# Altium schematic sheet OxygenSensor.SchDoc
size A4; SheetNumber: 5; SheetTotal: 10
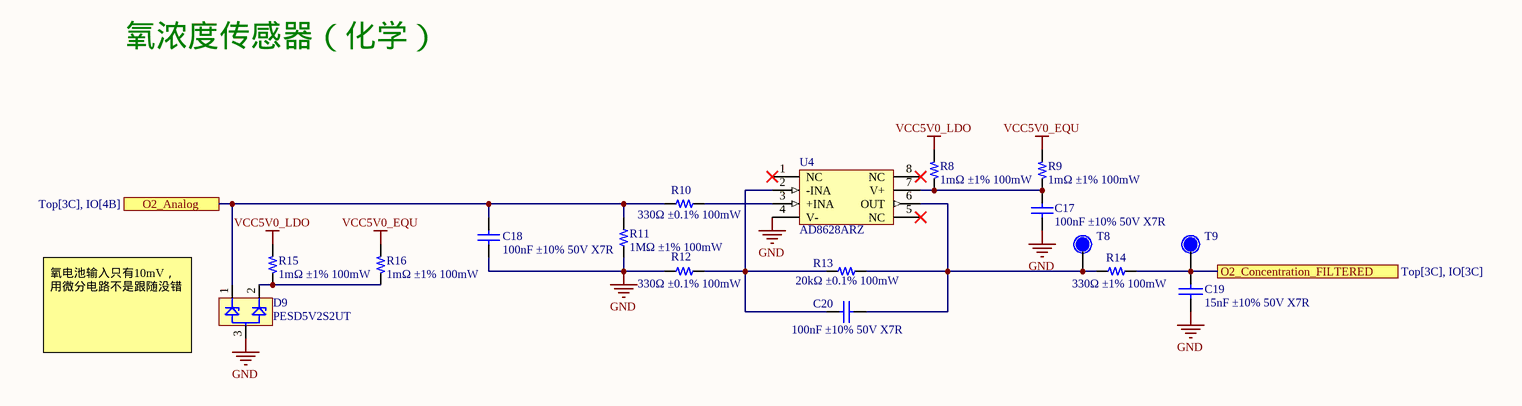
[diagram p0: OxygenSensor.SchDoc]

## Parts
C17  100nF ±10% 50V X7R  [C-0603]
C18  100nF ±10% 50V X7R  [C-0603]
C19  15nF ±10% 50V X7R  [C-0603]
C20  100nF ±10% 50V X7R  [C-0603]
D9  PESD5V2S2UT  [sot23-3]
R8  1mΩ ±1% 100mW  [R-0603]
R9  1mΩ ±1% 100mW  [R-0603]
R10  330Ω ±0.1% 100mW  [R-0603]
R11  1MΩ ±1% 100mW  [R-0603]
R12  330Ω ±0.1% 100mW  [R-0603]
R13  20kΩ ±0.1% 100mW  [R-0603]
R14  330Ω ±1% 100mW  [R-0603]
R15  1mΩ ±1% 100mW  [R-0603]
R16  1mΩ ±1% 100mW  [R-0603]
T8  Test?  [TestPad_SMD]  (value not drawn)
T9  Test?  [TestPad_SMD]  (value not drawn)
U4  AD8628ARZ  [SOIC8]

## Ports
O2_Analog (see Top[3C], IO[4B]), O2_Concentration_FILTERED (see Top[3C], IO[3C])

## Nets
GND: C17.2 C18.1 C19.1 D9.3 R11.2 R12.1(TOP) U4.4(V-)
VCC5V0_EQU: R9.2(BOT) R16.2(BOT)
VCC5V0_LDO: R8.2(BOT) R15.2(BOT)
O2_Analog: C18.2 D9.1 R10.1(TOP) R11.1 ; port O2_Analog
O2_Concentration_FILTERED: C19.2 R14.1 T9.1 ; port O2_Concentration_FILTERED
NetC17_1: C17.1 R8.1(TOP) R9.1(TOP) U4.7(V+)
NetC20_1: C20.1 R12.2(BOT) R13.1(TOP) U4.2(-INA)
NetC20_2: C20.2 R13.2(BOT) R14.2 T8.1 U4.6(OUT)
NetD9_2: D9.2 R15.1(TOP) R16.1(TOP)
NetR10_2: R10.2(BOT) U4.3(+INA)

Not connected (* = marked no-connect by the designer): U4 1(NC)* 5(NC)* 8(NC)*

## Notes on the sheet
- 氧浓度传感器（化学）
- (near D9) 氧电池输入只有10mV，用微分电路不是跟随没错

## Library data of the parts
C17 C18 C20 = 100nF_1: 物料编号: 210001894; 详细描述: X7R,50V,三星CL21B104JBCNNNC; 版本: V1.00; 名称: 贴片瓷介电容100nF±5%,0805; 制造商: 三星
C19 = CAP: Capacitor
D9 = PESDxS2UT
R8 R9 R15 R16 = 10K_1: 国巨 / 1mΩ ±1% 100mW; 版本: V1.00; 名称: 贴片电阻10K±1%; 物料编号: 210001830; 详细描述: 0805,1/8W,国巨RC0805FR-0710K; 制造商: 国巨
R10 R12 = 330Ω_1: 国巨RC0805FR-07330R; 物料编号: 210000706; 详细描述: 0805,1/8W,国巨RC0805FR-07330R; 制造商: 国巨; 版本: V1.00; 名称: 贴片电阻330±1%
R11 R14 = R-0603
R13 = 12K_1: 国巨RC0805FR-0712K; 物料编号: 210000764; 详细描述: 0805,1/8W,国巨RC0805FR-0712K; 制造商: 国巨; 版本: V1.00; 名称: 贴片电阻12K±1%
T8 T9 = TestPad_SMD
U4 = AD8628ARZ: 版本: V1.00; 名称: 芯片AD8628ARZ; 物料编号: 210001135; 详细描述: 精密运放AD8628ARZ ,SOIC8,-40℃+125℃; 制造商: ADI